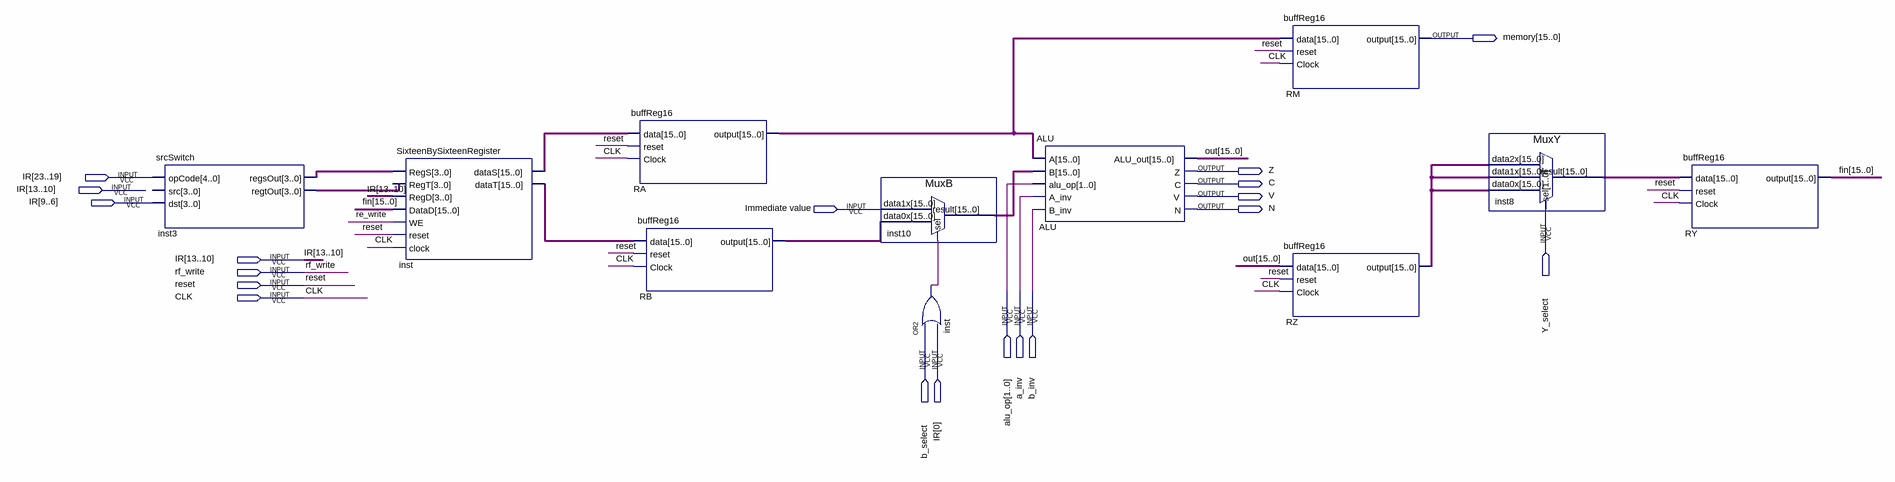
[diagram p0: schematic sheet]
// Quartus schematic DataPath.bdf as structural Verilog: 11 symbols, 19 pins
module DataPath (
  input  [23:0] IR,
  input  \Immediate_value ,
  input  Y_select,
  input  rf_write,
  input  reset,
  input  [1:0] alu_op,
  input  a_inv,
  input  b_inv,
  input  CLK,
  input  b_select,
  output [15:0] memory,
  output Z,
  output C,
  output V,
  output N
);

  wire inst_out, re_write;
  wire [3:0] inst3_regsout, inst3_regtout;
  wire [15:0] fin, inst8_result, inst10_result, inst_datas, inst_datat, out, RA_output, RB_output, RZ_output;

  srcSwitch inst3 (.opCode(IR[23:19]), .regsOut(inst3_regsout), .regtOut(inst3_regtout));  // open: src, dst
  SixteenBySixteenRegister inst (
    .RegS(inst3_regsout), .RegD(IR[13:10]), .DataD(fin), .WE(re_write), .reset(reset), .clock(CLK),
    .dataS(inst_datas), .dataT(inst_datat));  // open: RegT
  buffReg16 RA (.data(inst_datas), .reset(reset), .Clock(CLK), .\output (RA_output));
  buffReg16 RB (.data(inst_datat), .reset(reset), .Clock(CLK), .\output (RB_output));
  MuxB inst10 (.data1x({16{\Immediate_value }}), .data0x(RB_output), .sel(inst_out), .result(inst10_result));
  or inst_dup2 (inst_out, b_select, IR[0]);
  ALU ALU (
    .A(RA_output), .B(inst10_result), .alu_op(alu_op), .A_inv(a_inv), .B_inv(b_inv), .ALU_out(out), .Z(Z),
    .C(C), .V(V), .N(N));
  buffReg16 RM (.data(RA_output), .reset(reset), .Clock(CLK), .\output (memory));
  buffReg16 RZ (.data(out), .reset(reset), .Clock(CLK), .\output (RZ_output));
  MuxY inst8 (.data2x(RZ_output), .data1x(RZ_output), .data0x(RZ_output), .sel({2{Y_select}}), .result(inst8_result));
  buffReg16 RY (.data(inst8_result), .reset(reset), .Clock(CLK), .\output (fin));
endmodule
